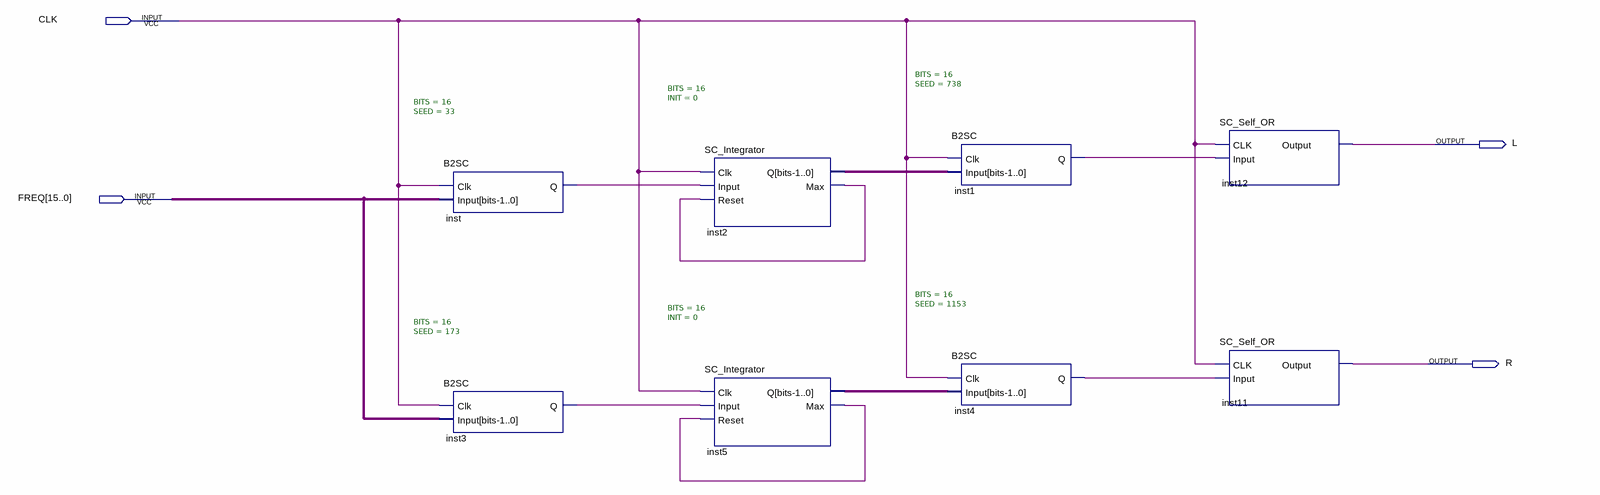
[diagram p0: schematic sheet]
// Quartus schematic OSC_Sawtooth.bdf as structural Verilog: 8 symbols, 4 pins
module OSC_Sawtooth (
  input  CLK,
  input  [15:0] FREQ,
  output L,
  output R
);

  wire inst1_q, inst2_max, inst3_q, inst4_q, inst5_max, inst_q;
  wire [15:0] inst2_q, inst5_q;

  B2SC #(.BITS(16), .SEED(33)) inst (.Clk(CLK), .Input(FREQ), .Q(inst_q));
  B2SC #(.BITS(16), .SEED(173)) inst3 (.Clk(CLK), .Input(FREQ), .Q(inst3_q));
  SC_Integrator #(.BITS(16), .INIT(0)) inst2 (
    .Clk(CLK), .Input(inst_q), .Reset(inst2_max), .Q(inst2_q), .Max(inst2_max));
  SC_Integrator #(.BITS(16), .INIT(0)) inst5 (
    .Clk(CLK), .Input(inst3_q), .Reset(inst5_max), .Q(inst5_q), .Max(inst5_max));
  B2SC #(.BITS(16), .SEED(738)) inst1 (.Clk(CLK), .Input(inst2_q), .Q(inst1_q));
  B2SC #(.BITS(16), .SEED(1153)) inst4 (.Clk(CLK), .Input(inst5_q), .Q(inst4_q));
  SC_Self_OR inst12 (.CLK(CLK), .Input(inst1_q), .Output(L));
  SC_Self_OR inst11 (.CLK(CLK), .Input(inst4_q), .Output(R));
endmodule
